# EasyEDA Pro project ProPrj_电磁铁控制_2024-08-31.epro

# Schematic Schematic1
Create Date: 2024-06-27; Page Name: P1; Project Name: 电磁铁控制; Schematic Name: Schematic1; Update Date: 2024-07-03; Company: 嘉立创EDA; Page Size: A4; Version: V1.0
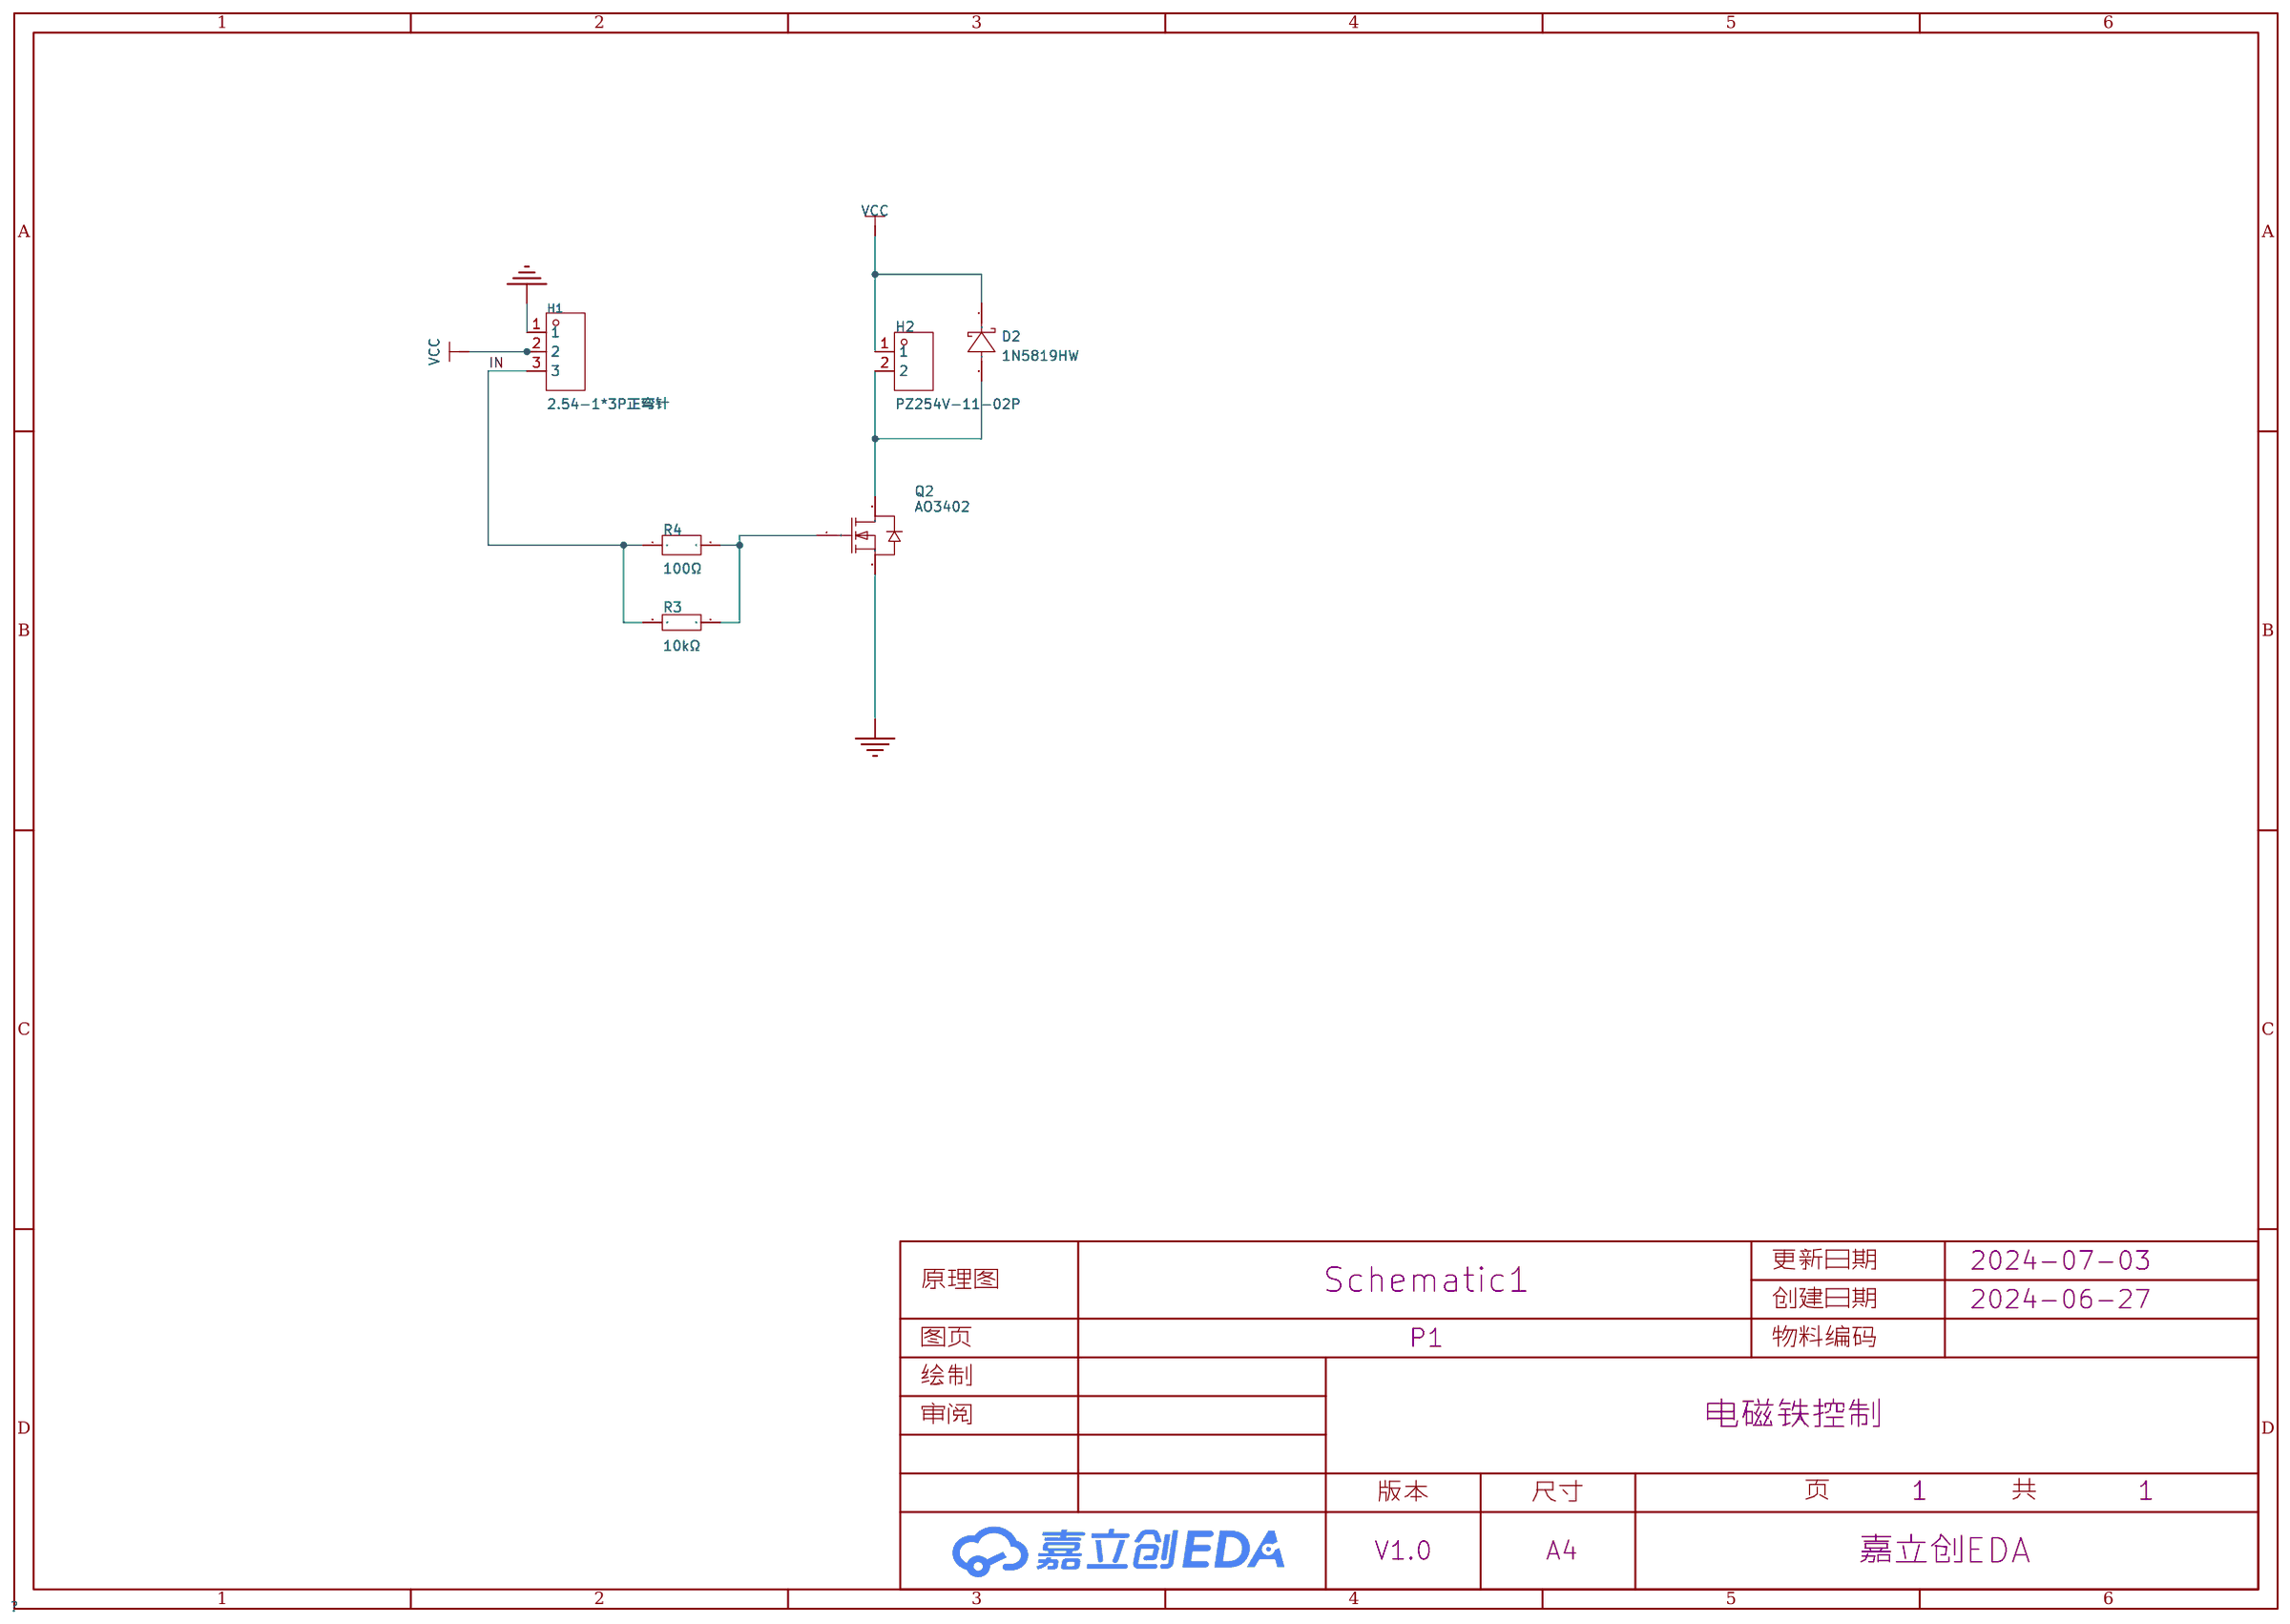
[diagram p0: schematic sheet]

## Parts
D2  1N5819HW  [SOD-123_L2.7-W1.6-LS3.7-RD-1]
H1  2.54-1*3P正弯针  [HDR-TH_3P-P2.54-H-M-BW7.2-P]
H2  PZ254V-11-02P  [HDR-TH_2P-P2.54-V-M]
Q2  AO3402  [SOT-23_L2.9-W1.3-P1.90-LS2.4-BR]
R3  10kΩ  [R0603]
R4  100Ω  [R0603]

## Library data of the parts
D2 = 1N5819HW: 二极管配置:-;正向压降(Vf):900mV@3A;直流反向耐压(Vr):40V;平均整流电流(Io):1A;; LCSC Part Name: 电压:40V 电流:1A; Supplier Part: C2905649; Manufacturer: TECH PUBLIC(台舟); Supplier Footprint: SOD-123; JLCPCB Part Class: 扩展库; Datasheet: https://atta.szlcsc.com/upload/public/pdf/source/20211020/8C6B6169F42B21129AF0D528B0E96B00.pdf; Supplier: LCSC; Forward Voltage (Vf@If): 900mV@3A; Reverse Voltage (Vr): 40V; Average Rectified Current (Io): 1A; Reverse Leakage Current (Ir): 1mA@40V
H1 = 2.54-1*3P正弯针: 插针结构:1x3P;间距:2.54mm;行距:-;圆针/方针:方针;安装类型:弯插;排数:单排;总PIN位数:3P;额定电流:3A;额定电压:-;配合针长度:3mm;塑高:2.54mm;端接针长度:-;触头材质:-;触头镀层:-;工作温度范围:-55℃~+105℃;颜色:黑色;; LCSC Part Name: 间距:2.54mm 1x3P 弯插 方针; Supplier Part: C92159; Manufacturer: BOOMELE(博穆精密); Supplier Footprint: 弯插,P=2.54mm; Datasheet: https://atta.szlcsc.com/upload/public/pdf/source/20181121/C2334_B051029C4931EB562F9DCCAAD18AC88A.pdf; Supplier: LCSC; Pin Structure: 1x3P; Pitch: 2.54mm; Circluar Pins/Square Pins: 方针; Mounting Type: 弯插; Number of Rows: 单排; Number of Pins: 3P; Current Rating (Max): 3A; Length of Mating Pin: 3mm; Insulation Height: 2.54mm; Operating Temperature Range: -55℃~+105℃; Color: 黑色
H2 = PZ254V-11-02P: 插针结构:1x2P;间距:2.54mm;行距:-;圆针/方针:方针;安装类型:直插;排数:单排;总PIN位数:2P;额定电流:-;额定电压:-;配合针长度:6mm;塑高:2.5mm;端接针长度:3mm;触头材质:黄铜;触头镀层:-;工作温度范围:-40℃~+105℃;颜色:黑色;; LCSC Part Name: 间距:2.54mm 1x2P 直插 方针; Supplier Part: C492401; Manufacturer: XFCN(兴飞); Supplier Footprint: 插件,P=2.54mm; Datasheet: https://atta.szlcsc.com/upload/public/pdf/source/20200309/C492401_A812433581A9B211A7FFA413ADDFF0E5.pdf; Supplier: LCSC; Pin Structure: 1x2P; Pitch: 2.54mm; Circluar Pins/Square Pins: 方针; Mounting Type: 直插; Number of Rows: 单排; Number of Pins: 2P; Length of Mating Pin: 6mm; Insulation Height: 2.5mm; Length of End Connection Pin: 3mm; Contact Material: 黄铜; Operating Temperature Range: -40℃~+105℃; Color: 黑色
Q2 = AO3402: 类型:1个N沟道;漏源电压(Vdss):30V;连续漏极电流(Id):4A;功率(Pd):1.4W;导通电阻(RDS(on)@Vgs,Id):55mΩ@10V,4A;阈值电压(Vgs(th)@Id):1.4V@250uA;; LCSC Part Name: 1个N沟道 耐压:30V 电流:4A; Supplier Part: C14385; Manufacturer: AOS; Supplier Footprint: SOT-23; JLCPCB Part Class: 扩展库; Datasheet: https://atta.szlcsc.com/upload/public/pdf/source/20171023/C14385_15087455190191052858.pdf; Supplier: LCSC; Type: 1个N沟道; Drain Source Voltage (Vdss): 30V; Continuous Drain Current (Id): 4A; Power Dissipation (Pd): 1.4W; Drain Source On Resistance (RDS(on)@Vgs,Id): 55mΩ@10V,4A; Gate Threshold Voltage (Vgs(th)@Id): 1.4V@250uA; Total Gate Charge (Qg@Vgs): 4.34nC@4.5V; Input Capacitance (Ciss@Vds): 390pF@15V; Operating Temperature: -55℃~+150℃@(Tj)
R3 = 0603WAF1002T5E: 电阻类型:厚膜电阻;阻值:10kΩ;精度:±1%;功率:100mW;最大工作电压:75V;温度系数:±100ppm/℃;; LCSC Part Name: 厚膜电阻 10kΩ ±1% 100mW; Supplier Part: C25804; Manufacturer: UNI-ROYAL(厚声); Supplier Footprint: 0603; Datasheet: https://atta.szlcsc.com/upload/public/pdf/source/20200306/C422600_1E6D84923E4A46A82E41ADD87F860B5C.pdf; Supplier: LCSC; Type: 厚膜电阻; Tolerance: ±1%; Power(Watts): 100mW; Overload Voltage (Max): 75V; Temperature Coefficient: ±100ppm/℃; Operating Temperature Range: -55℃~+155℃
R4 = TNPU0603100RAZEN00: 电阻类型:薄膜电阻;阻值:100Ω;精度:±0.05%;功率:100mW;最大工作电压:75V;温度系数:±5ppm/℃;; LCSC Part Name: 薄膜电阻 100Ω ±0.05% 100mW; Supplier Part: C2076398; Manufacturer: VISHAY(威世); Supplier Footprint: 0603; JLCPCB Part Class: 扩展库; Datasheet: https://atta.szlcsc.com/upload/public/pdf/source/20210607/368D46D70FD0A8291112754664578F50.pdf; Supplier: LCSC; Type: 薄膜电阻; Tolerance: ±0.05%; Power(Watts): 100mW; Overload Voltage (Max): 75V; Temperature Coefficient: ±5ppm/℃; Operating Temperature Range: -55℃~+125℃

## Nets
GND: H1.1 Q2.2(S)
VCC: D2.1(K) H1.2 H2.1
IN: H1.3 R3.2 R4.1
$1N1161: D2.2(A) H2.2 Q2.3(D)
$1N1264: Q2.1(G) R3.1 R4.2

# Board PCB1
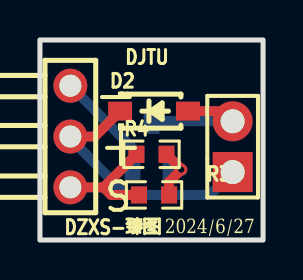
[diagram p1: board, top side]
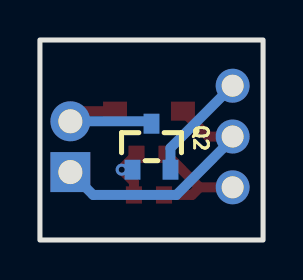
[diagram p2: board, bottom side, seen from below]

Outline 11.18 x 10 mm; copper layers: Top Layer, Bottom Layer. Coordinates in mm from the lower left corner of the outline.
Outline path: rectangle 0,10 11.18,0
Stack: Top Layer 0.035mm / Dielectric1 1.51mm FR4 er 4.5 / Bottom Layer 0.035mm

## Design rules (mm)
template: JLCPCB Capability(Two Layers Board)
spacing copperThickness1oz (default): track to track 0.102, other pairs 0.152 to 0.3
spacing copperThickness2oz: track to track 0.203, other pairs 0.152 to 0.3
track width copperThickness1oz (default): min 0.127, default 0.254, max 2.54
track width copperThickness2oz: min 0.203, default 0.254, max 2.54
differential pair differentialPair (default): width min 0.127, default 0.254, max 2.54; gap min 0.152, default 0.152
via viaSize (default): diameter min 0.5, default 0.61, max 10; hole min 0.3, default 0.305, max 6.3

## Placement (name value [footprint] x y rotation side)
D2  1N5819HW  [SOD-123_L2.7-W1.6-LS3.7-RD-1]  5.72 6.44 0 top
H1  2.54-1*3P正弯针  [HDR-TH_3P-P2.54-H-M-BW7.2-P]  1.52 5.17 270 top
H2  PZ254V-11-02P  [HDR-TH_2P-P2.54-V-M]  9.65 4.67 90 top
Q2  AO3402  [SOT-23_L2.9-W1.3-P1.90-LS2.4-BR]  5.59 4.67 270 bottom
R3  10kΩ  [R0603]  5.72 2.25 180 top
R4  100Ω  [R0603]  5.59 4.28 0 top

## Footprints (pads in the part's own frame, mm; a bottom-side part is the same pattern mirrored in y, then rotated)
HDR-TH_2P-P2.54-V-M
  rect 2x2 hole 1.2: 1(-1.27,0)
  round 2 hole 1.2: 2(1.27,0)
HDR-TH_3P-P2.54-H-M-BW7.2-P
  round 1.7 hole 1.1: 1(-2.54,0) 2(0,0) 3(2.54,0)
R0603
  rect 0.806x0.864 smd: 1(-0.753,0) 2(0.753,0)
SOD-123_L2.7-W1.6-LS3.7-RD-1
  rect 1.2x0.95 smd: 1(-1.7,0) 2(1.7,0)
SOT-23_L2.9-W1.3-P1.90-LS2.4-BR
  rect 1x0.8 smd: 1(1.15,-0.95) 2(1.15,0.95) 3(-1.15,0)

## Nets
As in the schematic.

## Via types
v1: diameter 0.61, hole 0.305, Top Layer to Bottom Layer, 1 via

## Routing (per net, layer and track width the routed paths; a pad name or vN(x,y) marks a point on that pad's centre or on a via; arc(x,y) is an arc through that point)
GND: length 5.5
  Bottom Layer w0.5: H1.1 4.64,4.6 Q2.2
VCC: length 12.9
  Top Layer w0.5: 4.01,6.44 2.75,5.17 H1.2
  Bottom Layer w0.5: H2.1 8.51,2.25 4.34,2.25 1.52,5.07 H1.2
IN: length 5.9
  Top Layer w0.5: 3.18,2.63 3.18,2.63 R4.1 ; 3.18,2.63 H1.3 ; 3.18,2.63 3.56,2.25 R3.2
$1N1161: length 6.6
  Top Layer w0.5: H2.2 9.14,6.44 D2.2
  Bottom Layer w0.5: H2.2 5.71,5.94 Q2.3
$1N1264: length 3.1
  Top Layer w0.5: R4.2 7.08,3.55 v1(7.08,3.52) 6.47,2.9 R3.1
  Bottom Layer w0.5: v1(7.08,3.52) Q2.1

## Text on the board
Top Silkscreen Layer: DJTU | - | + | s | DZXS-臻图 | 2024/6/27
